# Altium schematic sheet Part2.SchDoc
size A
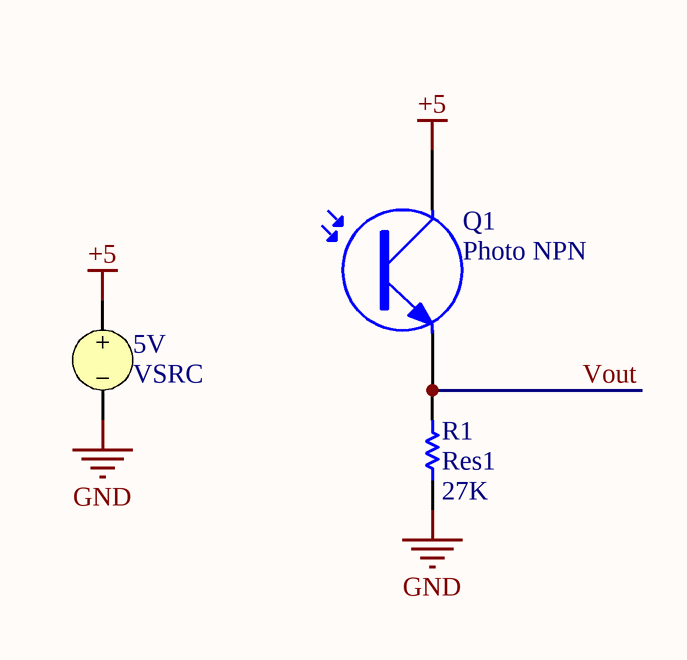
[diagram p0: Part2.SchDoc]

## Parts
5V  VSRC
Q1  Photo NPN  [SFM-T2(3)/X1.6V]
R1  Res1  value 27K  [AXIAL-0.3]

## Nets
+5: 5V.1 Q1.1(C)
GND: 5V.2 R1.1
Vout: Q1.3(E) R1.2

## Library data of the parts
5V = VSRC: Voltage Source; Note: PCB Footprint - Not required; Value: +5; Published: 8-Jun-2000; LatestRevisionDate: 17-Jul-2002; LatestRevisionNote: Re-released for DXP Platform.; PackageReference: Not Applicable; Publisher: Altium Limited
Q1 = Photo NPN: NPN Phototransistor; Manufacturer: Generic Components; Class: Optoelectronic; Published: 1999
R1 = Res1: Resistor; Manufacturer: Generic Components; Class: Passive; Published: 08/06/2000; Publisher: Altium Hobart Technology Centre; SubClass: Resistor